# Altium schematic sheet SZG-TEMPLATE-STD.SchDoc: SZG-TEMPLATE-STD
size B; Organization: Opal Kelly; Address1: 13500 SW 72nd Ave STE 100; Address2: Portland, OR  97223; Address3: 217.391.3724; Address4: http://www.opalkelly.com; DocumentNumber: xxx; Revision: 1; SheetNumber: 2; SheetTotal: 8; PageSetup: Record=PageOptions|CenterHorizontal=True|CenterVertical=True|PrintScale=0.52|XCorrection=1.00|YCorrection=1.00|PrintKind=0|BorderSize=5000000|LeftOffset=0|BottomOffset=0|Orientation=2|PaperLength=1000|PaperWidth=1000|Scale=100|PaperSource=7|PrintQuality=-4|MediaType=1|DitherType=10|PaperKind=Letter|PrintScaleMode=1
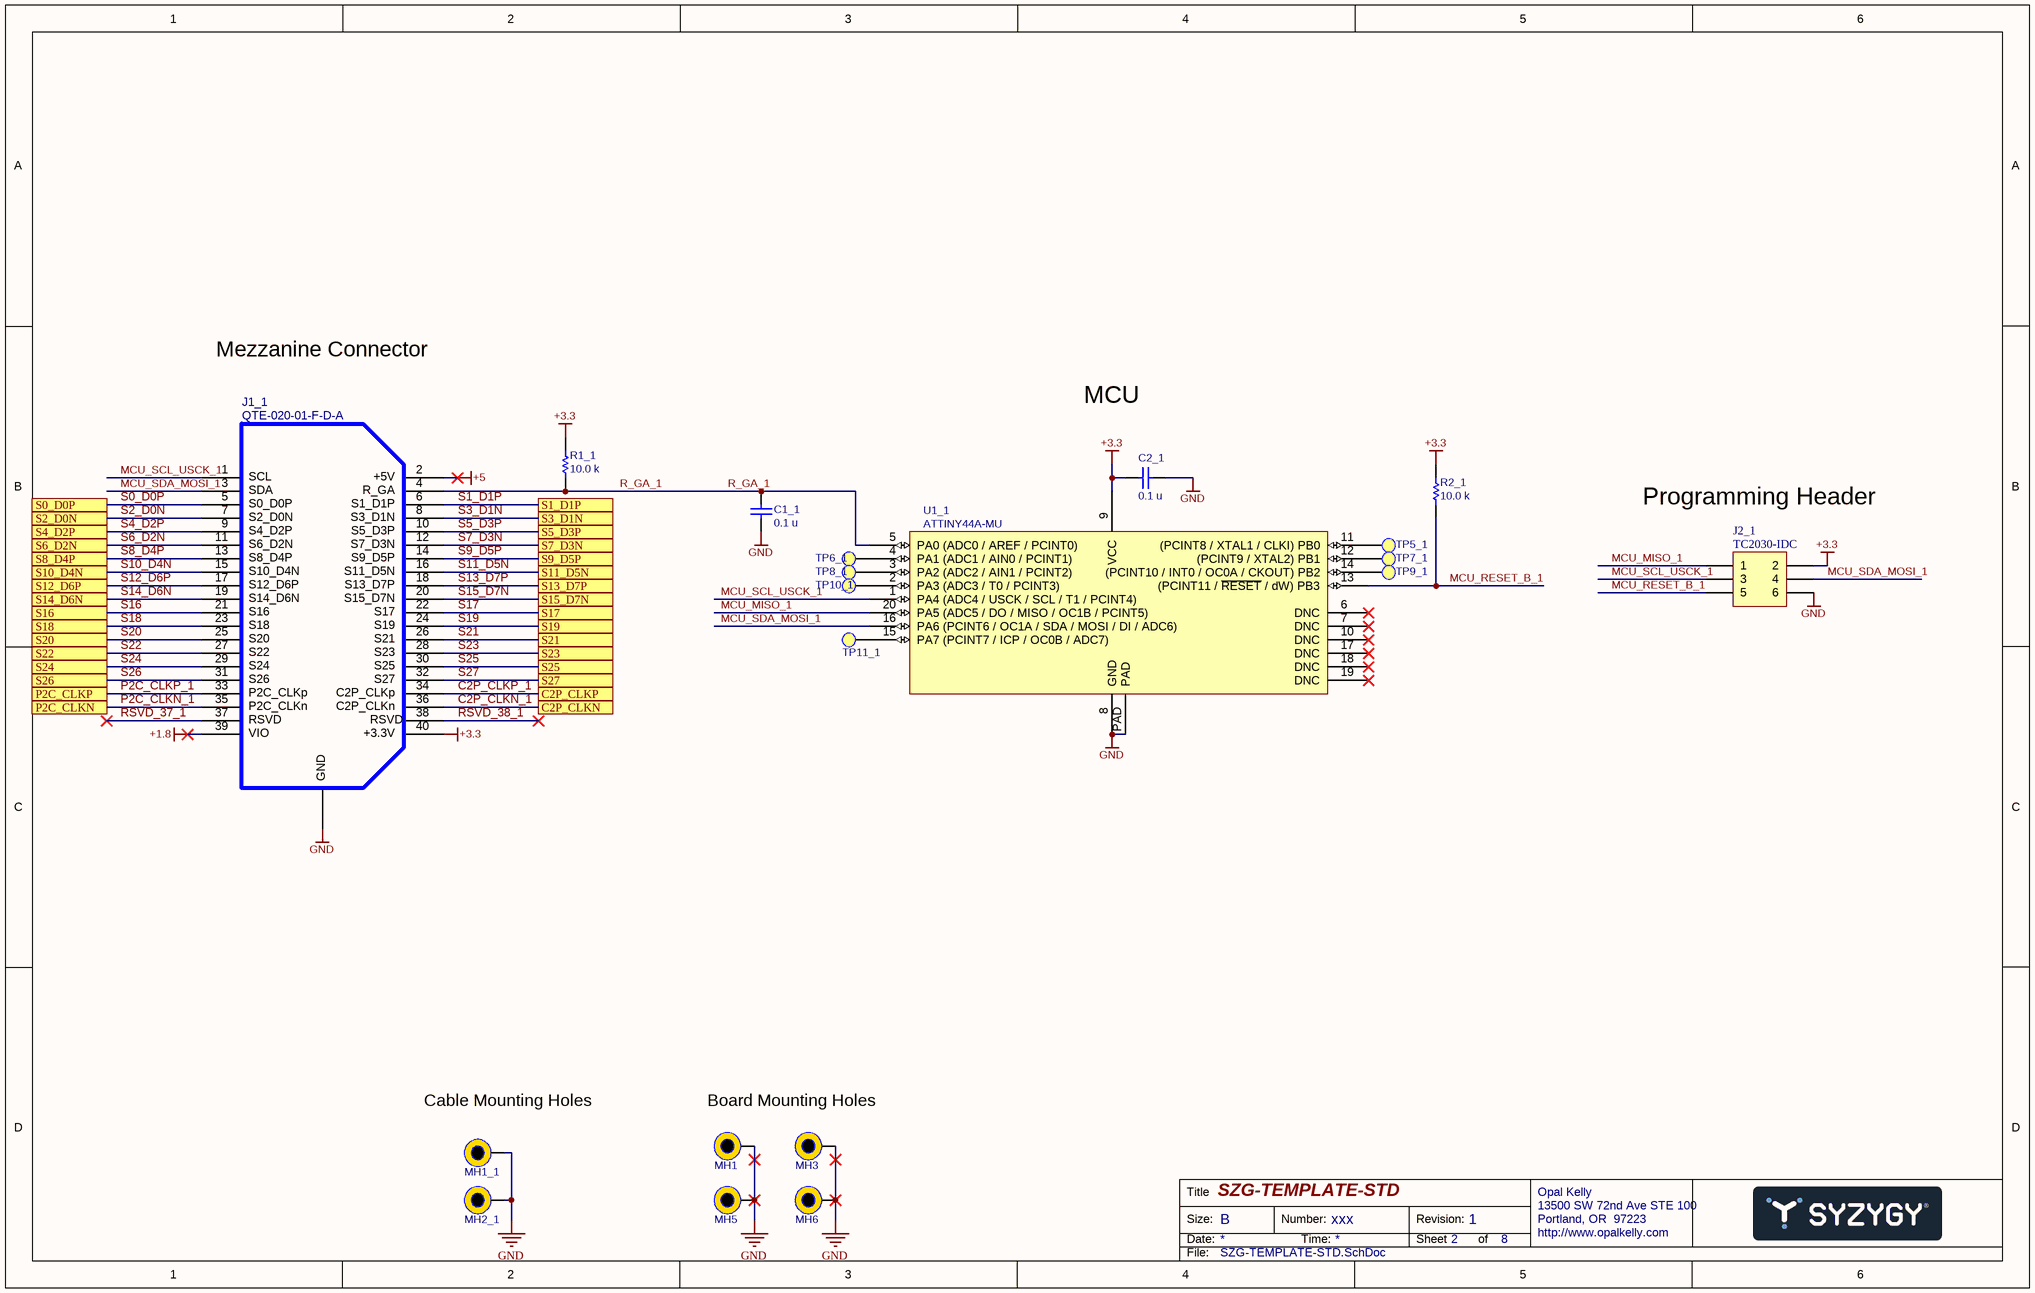
[diagram p0: SZG-TEMPLATE-STD.SchDoc]

## Parts
C1_1  value 0.1 u  [CAPC1005X06N]  (hidden comment: C0402C104K8PACTU)
C2_1  value 0.1 u  [CAPC1005X06N]  (hidden comment: C0402C104K8PACTU)
J1_1  QTE-020-01-F-D-A  [QTE-020-01-X-D-A-L]
J2_1  Manufacturer_PN: TC2030-IDC  [TC2030-DUAL]
MH1  MTG  [MTG-3.2/6.5-PTH]  (value not drawn)
MH1_1  MTG  [MTG-3.2/6.5-PTH]  (value not drawn)
MH2_1  MTG  [MTG-3.2/6.5-PTH]  (value not drawn)
MH3  MTG  [MTG-3.2/6.5-PTH]  (value not drawn)
MH5  MTG  [MTG-3.2/6.5-PTH]  (value not drawn)
MH6  MTG  [MTG-3.2/6.5-PTH]  (value not drawn)
R1_1  value 10.0 k  [RESC1005X06N]  (hidden comment: CRCW040210K0FKED)
R2_1  value 10.0 k  [RESC1005X06N]  (hidden comment: CRCW040210K0FKED)
TP5_1  TESTPOINT-SMD20  [TP-SMD20]  (value not drawn)
TP6_1  TESTPOINT-SMD20  [TP-SMD20]  (value not drawn)
TP7_1  TESTPOINT-SMD20  [TP-SMD20]  (value not drawn)
TP8_1  TESTPOINT-SMD20  [TP-SMD20]  (value not drawn)
TP9_1  TESTPOINT-SMD20  [TP-SMD20]  (value not drawn)
TP10_1  TESTPOINT-SMD20  [TP-SMD20]  (value not drawn)
TP11_1  TESTPOINT-SMD20  [TP-SMD20]  (value not drawn)
U1_1  ATTINY44A-MU  [QFN-EP-20]

## Ports
C2P_CLKN, C2P_CLKP, P2C_CLKN, P2C_CLKP, S0_D0P, S1_D1P, S2_D0N, S3_D1N, S4_D2P, S5_D3P, S6_D2N, S7_D3N, S8_D4P, S9_D5P, S10_D4N, S11_D5N, S12_D6P, S13_D7P, S14_D6N, S15_D7N, S16, S17, S18, S19, S20, S21, S22, S23, S24, S25, S26, S27

## Nets
+1.8: J1_1.39
+3.3: C2_1.2 J1_1.40 J2_1.2 R1_1.2 R2_1.2 U1_1.9(VCC)
+5: J1_1.2
GND: C1_1.1 C2_1.1 J1_1.0 J2_1.6 MH1.1 MH1_1.1 MH2_1.1 MH3.1 MH5.1 MH6.1 U1_1.8(GND) U1_1.PAD
C2P_CLKN_1: J1_1.36 ; port C2P_CLKN
C2P_CLKP_1: J1_1.34 ; port C2P_CLKP
MCU_MISO_1: J2_1.1 U1_1.20(PA5_(ADC5_/_DO_/_MISO_/_OC1B_/_PCINT5))
MCU_RESET_B_1: J2_1.5 R2_1.1 U1_1.13((PCINT11_/_~{RESET}_/_dW)_PB3)
MCU_SCL_USCK_1: J1_1.1 J2_1.3 U1_1.1(PA4_(ADC4_/_USCK_/_SCL_/_T1_/_PCINT4))
MCU_SDA_MOSI_1: J1_1.3 J2_1.4 U1_1.16(PA6_(PCINT6_/_OC1A_/_SDA_/_MOSI_/_DI_/_ADC6))
P2C_CLKN_1: J1_1.35 ; port P2C_CLKN
P2C_CLKP_1: J1_1.33 ; port P2C_CLKP
R_GA_1: C1_1.2 J1_1.4 R1_1.1 U1_1.5(PA0_(ADC0_/_AREF_/_PCINT0))
RSVD_37_1: J1_1.37
RSVD_38_1: J1_1.38
S0_D0P: J1_1.5 ; port S0_D0P
S1_D1P: J1_1.6 ; port S1_D1P
S2_D0N: J1_1.7 ; port S2_D0N
S3_D1N: J1_1.8 ; port S3_D1N
S4_D2P: J1_1.9 ; port S4_D2P
S5_D3P: J1_1.10 ; port S5_D3P
S6_D2N: J1_1.11 ; port S6_D2N
S7_D3N: J1_1.12 ; port S7_D3N
S8_D4P: J1_1.13 ; port S8_D4P
S9_D5P: J1_1.14 ; port S9_D5P
S10_D4N: J1_1.15 ; port S10_D4N
S11_D5N: J1_1.16 ; port S11_D5N
S12_D6P: J1_1.17 ; port S12_D6P
S13_D7P: J1_1.18 ; port S13_D7P
S14_D6N: J1_1.19 ; port S14_D6N
S15_D7N: J1_1.20 ; port S15_D7N
S16: J1_1.21 ; port S16
S17: J1_1.22 ; port S17
S18: J1_1.23 ; port S18
S19: J1_1.24 ; port S19
S20: J1_1.25 ; port S20
S21: J1_1.26 ; port S21
S22: J1_1.27 ; port S22
S23: J1_1.28 ; port S23
S24: J1_1.29 ; port S24
S25: J1_1.30 ; port S25
S26: J1_1.31 ; port S26
S27: J1_1.32 ; port S27
NetTP5_1_1: TP5_1.1(PIN) U1_1.11((PCINT8_/_XTAL1_/_CLKI)_PB0)
NetTP6_1_1: TP6_1.1(PIN) U1_1.4(PA1_(ADC1_/_AIN0_/_PCINT1))
NetTP7_1_1: TP7_1.1(PIN) U1_1.12((PCINT9_/_XTAL2)_PB1)
NetTP8_1_1: TP8_1.1(PIN) U1_1.3(PA2_(ADC2_/_AIN1_/_PCINT2))
NetTP9_1_1: TP9_1.1(PIN) U1_1.14((PCINT10_/_INT0_/_OC0A_/_CKOUT)_PB2)
NetTP10_1_1: TP10_1.1(PIN) U1_1.2(PA3_(ADC3_/_T0_/_PCINT3))
NetTP11_1_1: TP11_1.1(PIN) U1_1.15(PA7_(PCINT7_/_ICP_/_OC0B_/_ADC7))

Not connected (* = marked no-connect by the designer): U1_1 6(DNC)* 7(DNC)* 10(DNC)* 17(DNC)* 18(DNC)* 19(DNC)*

## Notes on the sheet
- Mezzanine Connector
- MCU
- Programming Header
- (near MH1_1) Cable Mounting Holes
- Board Mounting Holes
- Title
- Size:
- Date:
- B
- Number:
- Time:
- Revision:
- Sheet
- of
- File:
- (in symbol 000973) SCL; +5V; SDA; R_GA; S0_D0P; S1_D1P; S2_D0N; S3_D1N; S4_D2P; S5_D3P; S6_D2N; S7_D3N; S8_D4P; S9_D5P; S10_D4N; S11_D5N; S12_D6P; S13_D7P; S14_D6N; S15_D7N; S16; S17; S18; S19; S20; S21; S22; S23; S24; S25; S26; S27; P2C_CLKp; C2P_CLKp; P2C_CLKn; C2P_CLKn; RSVD; VIO; +3.3V; GND

## Library data of the parts
C1_1 C2_1 = 000070: Ceramic capacitor; Manufacturer: Kemet; partnumber: 000070; Description 2: SM-0402, 10%, 10v; ValueFloat: 1E-7; Tolerance (%): 10; Manufacturer_PN: C0402C104K8PACTU
  C1_1: updated_on: 5/15/2017 4:50:04 PM
  C2_1: updated_on: 11/17/2016 12:16:56 PM
J1_1 = 000973: Partnumber: 000973; manufacturer: Samtec; id: 24153; inventory_price: 3.86; created_on: 4/3/2013 1:34:16 PM; manufacturer_pn: QTE-020-01-F-D-A; parttype: Connector; rohs: 1; updated_on: 2/26/2018 2:13:14 PM
J2_1 = 002062: Tag-Connect 6-pin Plug-of-Nails spring-pin cable footprint; AligniPartNumber: 002062; Manufacturer: Tag-Connect; parttype: Connector
MH1 MH1_1 MH2_1 MH3 MH5 MH6 = MTG: Mounting hole
R1_1 R2_1 = 001521: Thick-film resistor; Manufacturer: Vishay; partnumber: 001521; Description 2: SM-0402, 1%, 1/16W; ValueFloat: 10000; Tolerance (%): 1; x_lifecycle_status: Production; Manufacturer_PN: CRCW040210K0FKED; updated_on: 3/21/2017 2:29:49 PM
TP5_1 TP6_1 TP7_1 TP8_1 TP9_1 TP10_1 TP11_1 = TESTPOINT-SMD20: Test point, surface-mount, 20mil
U1_1 = 001552: 8-bit MCU, 4 KB flash, 256 bytes EEPROM; Manufacturer: Microchip; partnumber: 001552; x_lifecycle_status: Production; Manufacturer_PN: ATTINY44A-MU; updated_on: 5/23/2017 10:51:21 AM